# EAGLE design freeduino_V1.16-TH-WestfW-newreg (EAGLE 4.16)
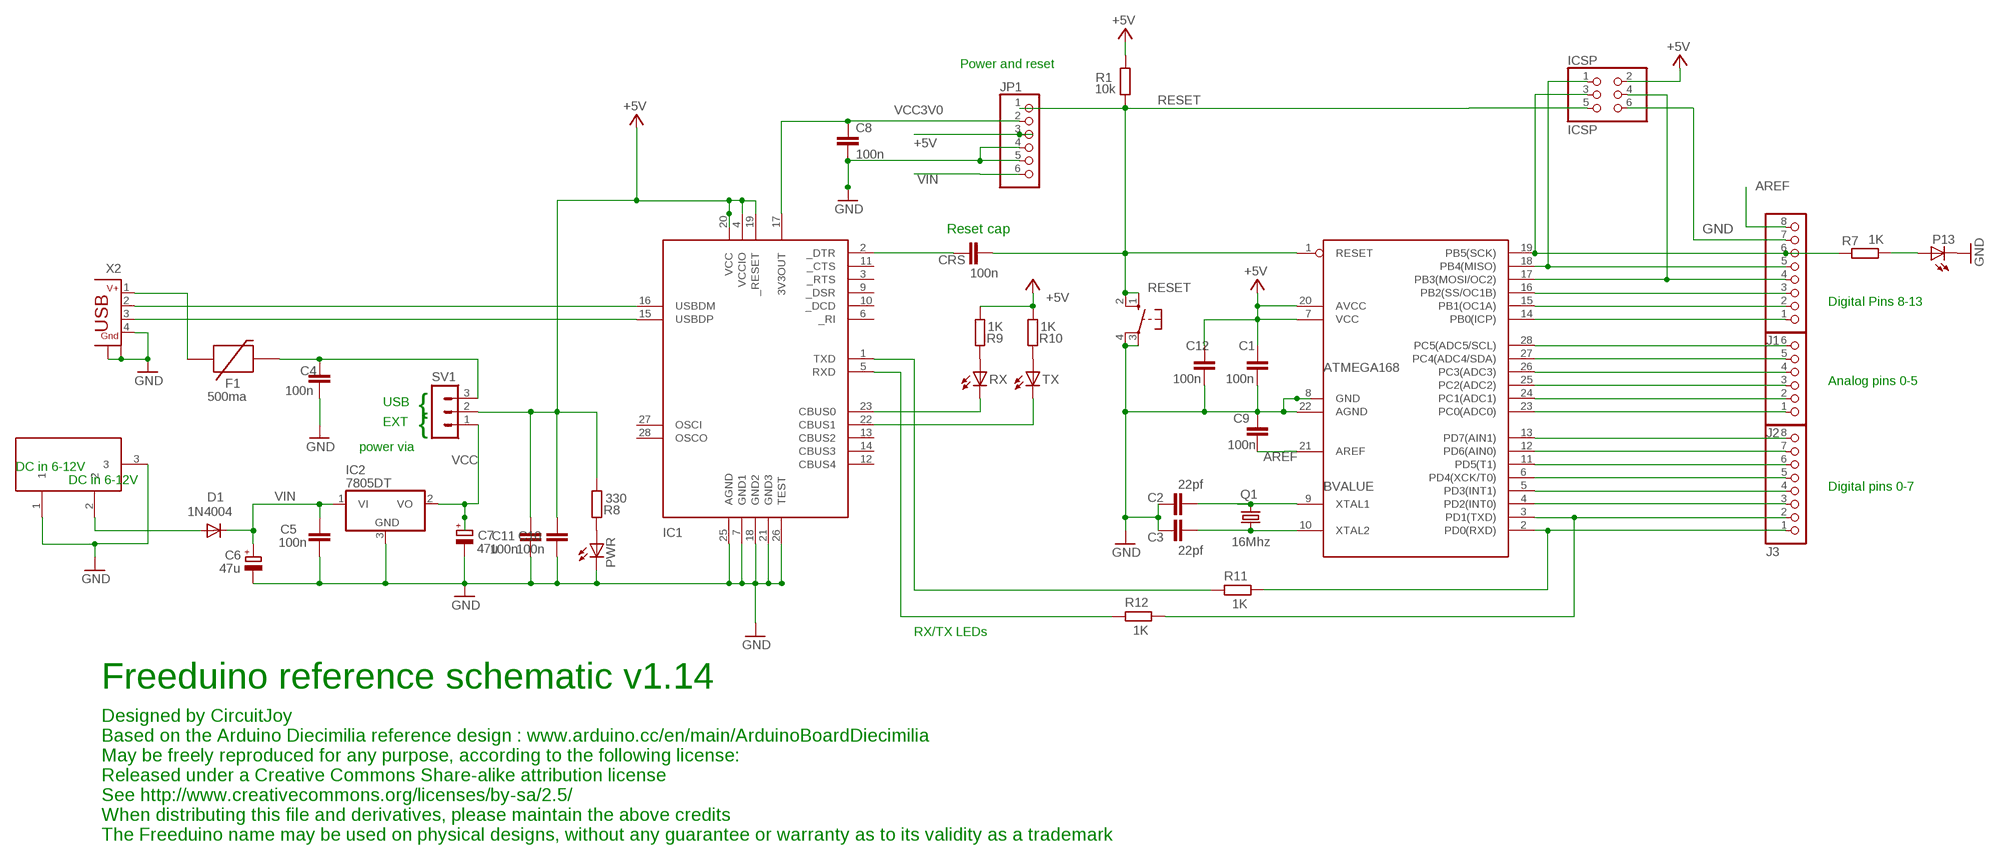
[diagram p0: schematic, sheet 1]

## Parts
BVALUE  ATMEGA168  MEGA8-P  [DIL28-3]
C1  100n  C-EU050-024X044  [C050-024X044]
C2  22pf  C-EU025-024X044  [C025-024X044]
C3  22pf  C-EU025-024X044  [C025-024X044]
C4  100n  C-EU050-024X044  [C050-024X044]
C5  100n  C-EU050-024X044  [C050-024X044]
C6  47u  CPOL-EUE3.5-8  [E3,5-8]
C7  47u  CPOL-EUE3.5-8  [E3,5-8]
C8  100n  C-EU050-024X044  [C050-024X044]
C9  100n  C-EU050-024X044  [C050-024X044]
C10  100n  C-EU050-024X044  [C050-024X044]
C11  100n  C-EUC1206  [C1206]
C12  100n  C-EU050-024X044  [C050-024X044]
CRS  100n  C-EU050-024X044  [C050-024X044]
D1  1N4004  DIODEPTH  [DIODE-0.4]
DC1  9V in  DC21MMX  [DC-21MM]
F1  500ma  PTCPTH  [PTC]
IC1  FT232RL  FT232RL-PINNED  [SSOP28DB]
IC2  7805DT  [TO252]
ICSP  ICSP  PINHD-2X3  [2X03]
J1  PINHD-1X8  [1X08]
J2  PINHD-1X6  [1X06]
J3  PINHD-1X8  [1X08]
JP1  PINHD-1X6  [1X06]
P13  LED3MM  [LED3MM]
PWR  LED3MM  [LED3MM]
Q1  16Mhz  CRYSTALHC49U-V  [HC49U-V]
R1  10k  R-EU_0204/7  [0204/7]
R7  1K  R-EU_0204/7  [0204/7]
R8  330  R-EU_0204/7  [0204/7]
R9  1K  R-EU_0204/7  [0204/7]
R10  1K  R-EU_0204/7  [0204/7]
R11  1K  R-EU_0204/7  [0204/7]
R12  1K  R-EU_0204/7  [0204/7]
RESET  10-XX  [B3F-10XX]
RX  LED3MM  [LED3MM]
SV1  MA03-1  [MA03-1]
TX  LED3MM  [LED3MM]
X2  CON-USB-B  [USB-WSHIELDPADS]

## Nets
+5V [power]: BVALUE.7(VCC) BVALUE.20(AVCC) C1.1 C10.2 C11.2 C12.1 IC1.4(VCCIO) IC1.19(_RESET) IC1.20(VCC) ICSP.2 JP1.3 R1.2 R8.1 R9.1 R10.1 SV1.2
AREF: BVALUE.21(AREF) C9.1 J1.8
GND [power]: BVALUE.8(GND) BVALUE.22(AGND) C1.2 C2.1 C3.1 C4.1 C5.1 C6.- C7.- C8.2 C9.2 C10.1 C11.1 C12.2 DC1.1 DC1.3 IC1.7(GND1) IC1.18(GND2) IC1.21(GND3) IC1.25(AGND) IC1.26(TEST) IC2.3(GND) ICSP.6 J1.7 JP1.4 JP1.5 P13.K(C) PWR.K(C) RESET.3(P) RESET.4(P1) X2.4 X2.SH1(GND) X2.SH2(GND)
M8RXD [finepitch]: IC1.1(TXD) R11.1
M8TXD [finepitch]: IC1.5(RXD) R12.1
N$2: BVALUE.15(PB1(OC1A)) J1.2
N$3: PWR.A R8.2
N$5 [finepitch]: IC1.23(CBUS0) RX.K(C)
N$6: BVALUE.9(XTAL1) C2.2 Q1.2
N$7 [power]: C4.2 F1.P$2 SV1.3
N$8 [power]: D1.A DC1.2
N$9 [finepitch]: IC1.16(USBDM) X2.2
N$10: BVALUE.4(PD2(INT0)) J3.3
N$11: BVALUE.5(PD3(INT1)) J3.4
N$12: BVALUE.6(PD4(XCK/T0)) J3.5
N$13: BVALUE.11(PD5(T1)) J3.6
N$14: BVALUE.12(PD6(AIN0)) J3.7
N$15: BVALUE.13(PD7(AIN1)) J3.8
N$16: BVALUE.23(PC0(ADC0)) J2.1
N$17: BVALUE.24(PC1(ADC1)) J2.2
N$18: BVALUE.25(PC2(ADC2)) J2.3
N$19: BVALUE.26(PC3(ADC3)) J2.4
N$20: BVALUE.27(PC4(ADC4/SDA)) J2.5
N$21: BVALUE.28(PC5(ADC5/SCL)) J2.6
N$22: BVALUE.3(PD1(TXD)) J3.2 R12.2
N$23: BVALUE.16(PB2(SS/OC1B)) J1.3
N$24 [finepitch]: IC1.15(USBDP) X2.3
N$26: BVALUE.18(PB4(MISO)) ICSP.1 J1.5
N$27 [power]: F1.P$1 X2.1
N$28: BVALUE.14(PB0(ICP)) J1.1
N$29 [finepitch]: IC1.22(CBUS1) TX.K(C)
N$31: BVALUE.10(XTAL2) C3.2 Q1.1
N$32: P13.A R7.1
N$34: R10.2 TX.A
N$36: R9.2 RX.A
N$37 [finepitch]: CRS.1 IC1.2(_DTR)
N$43: BVALUE.17(PB3(MOSI/OC2)) ICSP.4 J1.4
N$44: BVALUE.2(PD0(RXD)) J3.1 R11.2
RESET: BVALUE.1(RESET) CRS.2 ICSP.5 JP1.1 R1.1 RESET.1(S) RESET.2(S1)
SCK: BVALUE.19(PB5(SCK)) ICSP.3 J1.6 R7.2
VCC [power]: C7.+ IC2.2(VO) SV1.1
VCC3V0 [power]: C8.1 IC1.17(3V3OUT) JP1.2
VIN [power]: C5.2 C6.+ D1.C IC2.1(VI) JP1.6
Unconnected: IC1.3(_RTS) IC1.6(_RI) IC1.9(_DSR) IC1.10(_DCD) IC1.11(_CTS) IC1.12(CBUS4) IC1.13(CBUS2) IC1.14(CBUS3) IC1.27(OSCI) IC1.28(OSCO)

## Notes on the sheet
- Power and reset
- Reset cap
- Digital Pins 8-13
- Analog pins 0-5
- USB
- {
- EXT
- {
- power via
- DC in 6-12V
- DC in 6-12V
- Digital pins 0-7
- RX/TX LEDs
- Freeduino reference schematic v1.14
- Designed by CircuitJoy
- Based on the Arduino Diecimilia reference design : www.arduino.cc/en/main/ArduinoBoardDiecimilia
- May be freely reproduced for any purpose, according to the following license:
- Released under a Creative Commons Share-alike attribution license
- See http://www.creativecommons.org/licenses/by-sa/2.5/
- When distributing this file and derivatives, please maintain the above credits
- The Freeduino name may be used on physical designs, without any guarantee or warranty as to its validity as a trademark

## Library data of the parts
BVALUE = my-library:MEGA8-P: MICROCONTROLLER 8 Kbytes FLASH 1 kbytes SRAM 512 bytes EEPROM USART 4-channel 10 bit ADC 2-channel 8 bit ADC Source: avr.lbr
C1-C5 C8-C12 CRS = rcl:C-EU: CAPACITOR, European symbol
C6 C7 = rcl:CPOL-EU: POLARIZED CAPACITOR, European symbol
D1 = SparkFunEagle-6-6-07:DIODE: Diode These are standard reverse protection diodes and small signal diodes. SMA package can handle up to about 1A. SOD-323 can handle about 200mA. What the SOD-323 package when ordering, there are some mfgs out there that are 5-pin packages.
DC1 = powersupply:DC21MM
F1 = SparkFunEagle-6-6-07:PTC: Resettable Fuse PTC Resettable Fuse. Spark Fun Electronics SKU : COM-08357
IC1 = my-library:FT232RL-PINNED: USB UART FT232RL 4th Generation USB UART (USB <-> Serial) Controller. Spark Fun Electronics SKU : COM-00650
IC2 = linear:78*: Positive VOLTAGE REGULATOR Source: http://cache.national.com/ds/LM/LM78L05.pdf http://www.fairchildsemi.com/ds/LM/LM7805.pdf
ICSP = pinhead:PINHD-2X3: PIN HEADER
J1 J3 = pinhead:PINHD-1X8: PIN HEADER
J2 JP1 = pinhead:PINHD-1X6: PIN HEADER
P13 PWR RX TX = led:LED: LED OSRAM: - CHIPLED LG R971, LG N971, LY N971, LG Q971, LY Q971, LO R971, LY R971 LH N974, LH R974 LS Q976, LO Q976, LY Q976 LO Q996 - Hyper CHIPLED LW Q18S LB Q993, LB Q99A, LB R99A - SideLED LS A670, LO A670, LY A670, LG A670, LP A670 LB A673, LV A673, LT A673, LW A673 LH A674 LY A675 LS A676, LA A676, LO A676, LY A676, LW A676 LS A679, LY A679, LG A679 - Hyper Micro SIDELED® LS Y876, LA Y876, LO Y876, LY Y876 LT Y87S - SmartLED LW L88C, LW L88S LB L89C, LB L89S, LG L890 LS L89K, LO L89K, LY L89K LS L896, LA L896, LO L896, LY L896 - TOPLED LS T670, LO T670, LY T670, LG T670, LP T670 LSG T670, LSP T670, LSY T670, LOP T670, LYG T670 LG T671, LOG T671, LSG T671 LB T673, LV T673, LT T673, LW T673 LH T674 LS T676, LA T676, LO T676, LY T676, LB T676, LH T676, LSB T676, LW T676 LB T67C, LV T67C, LT T67C, LS T67K, LO T67K, LY T67K, LW E67C LS E67B, LA E67B, LO E67B, LY E67B, LB E67C, LV E67C, LT E67C LW T67C LS T679, LY T679, LG T679 LS T770, LO T770, LY T770, LG T770, LP T770 LB T773, LV T773, LT T773, LW T773 LH T774 LS E675, LA E675, LY E675, LS T675 LS T776, LA T776, LO T776, LY T776, LB T776 LHGB T686 LT T68C, LB T68C - Hyper Mini TOPLED® LB M676 - Mini TOPLED Santana® LG M470 LS M47K, LO M47K, LY M47K Source: http://www.osram.convergy.de/
Q1 = crystal:CRYSTAL: CRYSTAL
R1 R7-R12 = rcl:R-EU_: RESISTOR, European symbol
RESET = switch-omron:10-XX: OMRON SWITCH
SV1 = con-lstb:MA03-1: PIN HEADER
X2 = mylib4:CON-USB-B: BERG USB connector

## Net classes
0 default: width 0.203 mm, drill 0.203 mm
1 power: width 0.6 mm, drill 0.305 mm
2 finepitch: width 0.203 mm, drill 0.203 mm

## Board
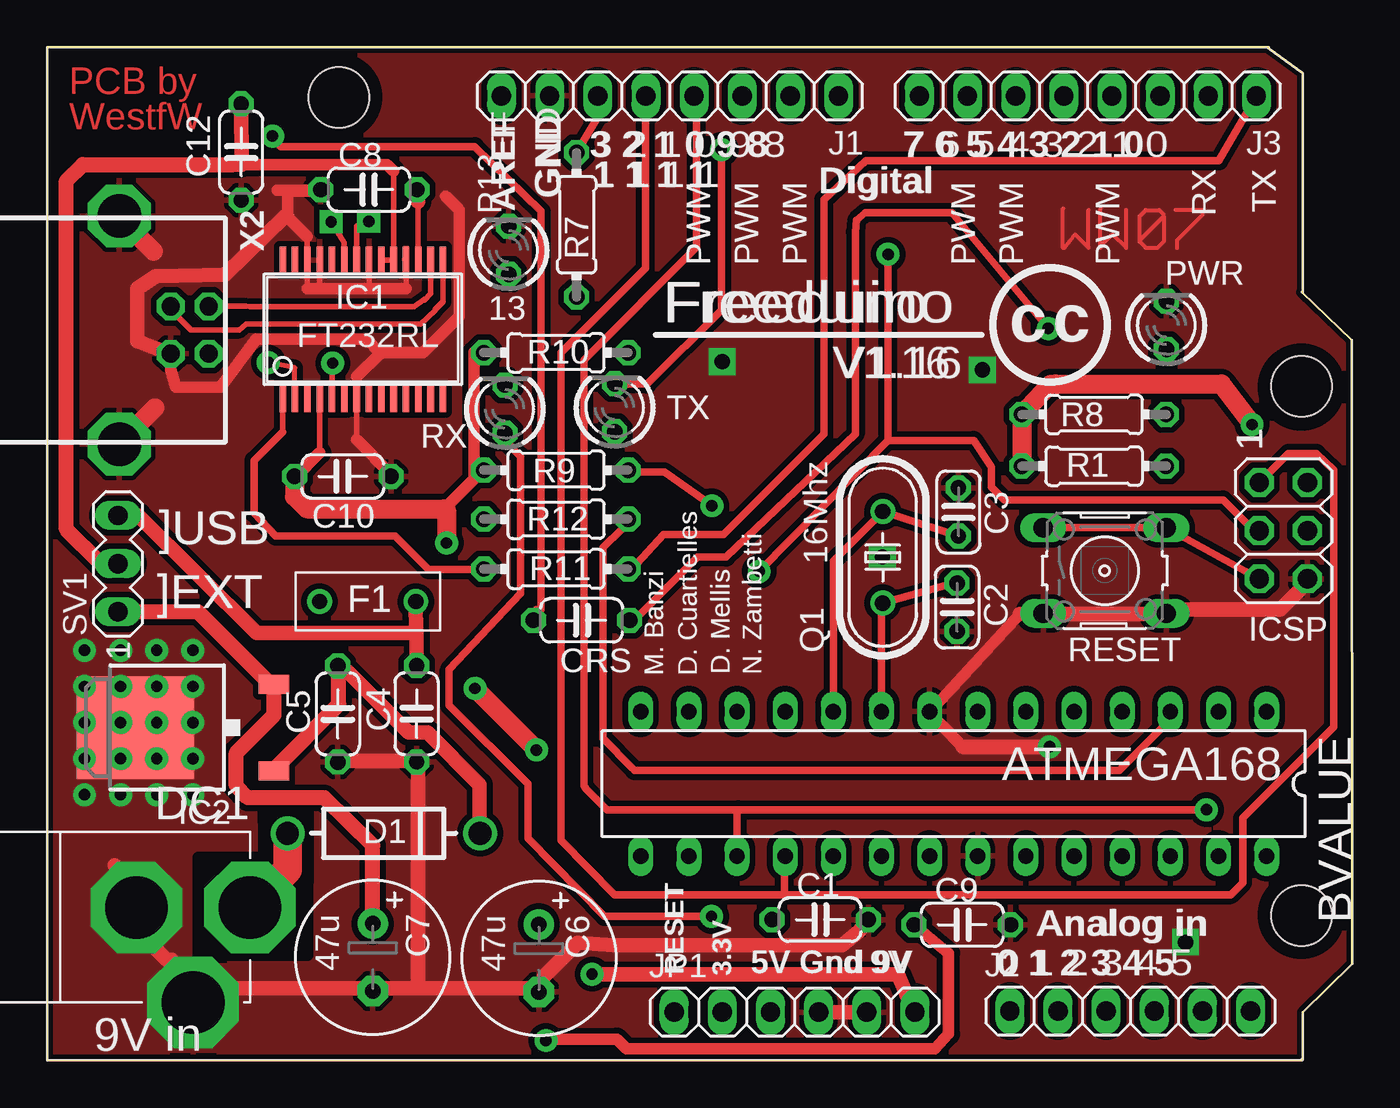
[diagram p1: board, top side]
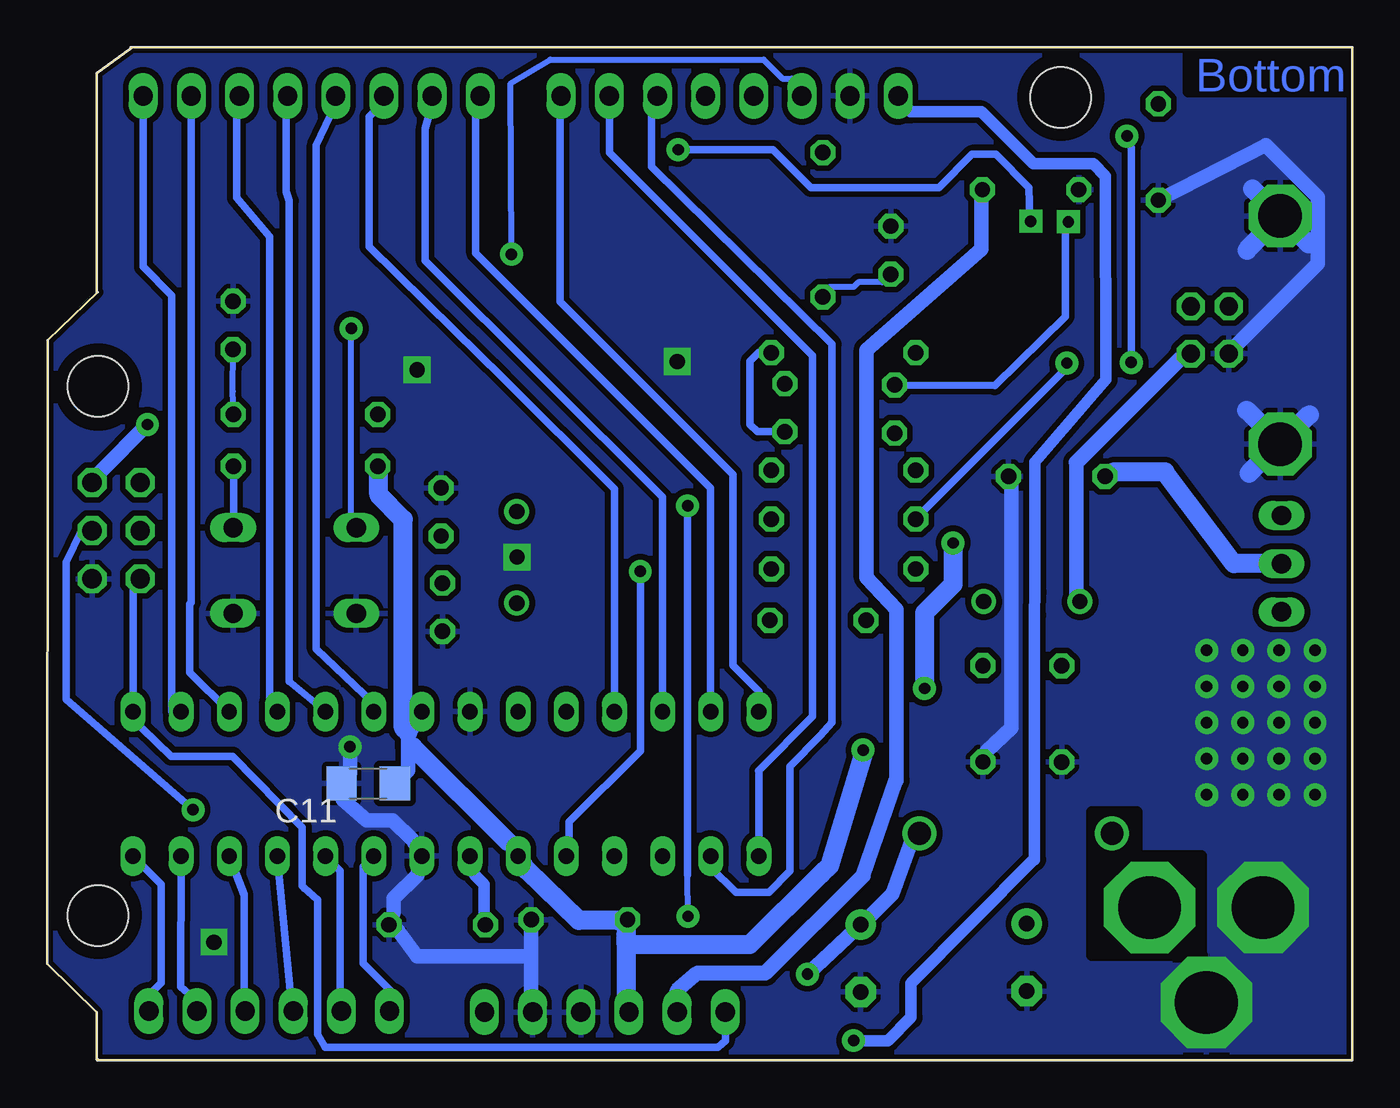
[diagram p2: board, bottom side, seen from below]

Size 68.83 x 53.44 mm. Coordinates in mm from the lower left corner, seen from the top.
Outline: 66.2,0.03 66.22,0.06 66.22,2.55 68.83,5.1
Outline: 66.22,40.54 66.22,52.09 64.39,53.44
Outline: 66.18,0.05 66.2,0 63.63,0.01 0,0.01 0,53.44 64.44,53.44
Outline: 68.83,5.11 68.81,38 66.17,40.54
Copper layers (1*16): Top 0.035mm / dielectric 1.5mm / Bottom 0.035mm
Design rules "default": minimum track width 10mil, minimum drill 0.6mm, track to track 8mil, track to pad 8mil, pad to pad 8mil, via to via 12mil, smd to smd 8mil, copper to edge 10mil, drill to drill 15mil, minimum pad ring 10mil, minimum via ring 12mil, stop-mask expansion 4mil, vias tented up to drill 0mil, thermal gap 10mil
Holes 3.2 mm at 66.17,35.57 66.17,7.63 15.37,50.81
tRestrict: area 13.5,48.9 to 17.3,52.7; area 64.3,33.6 to 68,37.4; area 64.3,5.8 to 68,9.6; 10 lines
bRestrict: area 13.5,48.9 to 17.3,52.7; area 64.3,33.6 to 68,37.4; area 64.3,5.8 to 68,9.6; 8 lines

### Footprints (pad centres in the part's own frame; a part is rotated, then mirrored left to right if it is on the bottom)
DIL28-3 = drill 0.813 long: 1 -16.51,-3.81; 2 -13.97,-3.81; 3 -11.43,-3.81; 4 -8.89,-3.81; 5 -6.35,-3.81; 6 -3.81,-3.81; 7 -1.27,-3.81; 8 1.27,-3.81; 9 3.81,-3.81; 10 6.35,-3.81; 11 8.89,-3.81; 12 11.43,-3.81; 13 13.97,-3.81; 14 16.51,-3.81; 15 16.51,3.81; 16 13.97,3.81; 17 11.43,3.81; 18 8.89,3.81; 19 6.35,3.81; 20 3.81,3.81; 21 1.27,3.81; 22 -1.27,3.81; 23 -3.81,3.81; 24 -6.35,3.81; 25 -8.89,3.81; 26 -11.43,3.81; 27 -13.97,3.81; 28 -16.51,3.81
C050-024X044 = drill 0.813 octagon: 1 -2.54,0; 2 2.54,0
C025-024X044 = drill 0.813 octagon: 1 -1.27,0; 2 1.27,0
E3,5-8 = drill 0.813 pad 1.6 round: + -1.778,0 | drill 0.813 pad 1.6 octagon: - 1.778,0
C1206 = smd 1.6 x 1.8: 1 -1.4,0; 2 1.4,0
DIODE-0.4 = drill 1.2 round: A 0,0; C 10.16,0
DC-21MM = drill 3.302 pad 4.826 octagon: 1 -5.08,-3.353; 2 -0.076,-6.35; 3 -0.076,-0.356
PTC = drill 0.8 round: P$1 -2.54,0; P$2 2.54,0
SSOP28DB = smd 0.348 x 1.397: 1 -4.225,-3.656; 2 -3.575,-3.656; 3 -2.925,-3.656; 4 -2.275,-3.656; 5 -1.625,-3.656; 6 -0.975,-3.656; 7 -0.325,-3.656; 8 0.325,-3.656; 9 0.975,-3.656; 10 1.625,-3.656; 11 2.275,-3.656; 12 2.925,-3.656; 13 3.575,-3.656; 14 4.225,-3.656; 15 4.225,3.656; 16 3.575,3.656; 17 2.925,3.656; 18 2.275,3.656; 19 1.625,3.656; 20 0.975,3.656; 21 0.325,3.656; 22 -0.325,3.656; 23 -0.975,3.656; 24 -1.625,3.656; 25 -2.275,3.656; 26 -2.925,3.656; 27 -3.575,3.656; 28 -4.225,3.656
TO252 = smd 1 x 1.6: 1 -2.28,-4.8; 2 2.28,-4.8 | smd 5.4 x 6.2: 3 0,2.5
2X03 = drill 1.016 octagon: 1 -2.54,-1.27; 2 -2.54,1.27; 3 0,-1.27; 4 0,1.27; 5 2.54,-1.27; 6 2.54,1.27
1X08 = drill 1.016 long: 1 -8.89,0; 2 -6.35,0; 3 -3.81,0; 4 -1.27,0; 5 1.27,0; 6 3.81,0; 7 6.35,0; 8 8.89,0
1X06 = drill 1.016 long: 1 -6.35,0; 2 -3.81,0; 3 -1.27,0; 4 1.27,0; 5 3.81,0; 6 6.35,0
LED3MM = drill 0.813 octagon: A -1.27,0; K 1.27,0
HC49U-V = drill 0.813 round: 1 -2.413,0; 2 2.413,0
0204/7 = drill 0.813 octagon: 1 -3.81,0; 2 3.81,0
B3F-10XX = drill 1.016 long: 1 -3.251,2.261; 2 3.251,2.261; 3 -3.251,-2.261; 4 3.251,-2.261
MA03-1 = drill 1.016 long: 1 -2.54,0; 2 0,0; 3 2.54,0
USB-WSHIELDPADS = drill 0.95 octagon: 1 1.25,4.71; 2 -1.25,4.71; 3 -1.25,2.71; 4 1.25,2.71 | drill 2.3 octagon: SH1 -6.02,0; SH2 6.02,0

### Placement (x,y rotation side)
BVALUE  47.81,14.59 180 top
C1  40.76,7.42 0 top
C2  47.99,23.91 90 top
C3  48.06,28.94 270 top
C4  19.48,18.29 90 top
C5  15.32,18.27 90 top
C6  25.93,5.39 270 top
C7  17.16,5.43 270 top
C8  16.96,45.94 180 top
C9  48.26,7.15 0 top
C10  15.58,30.81 180 top
C11  51.9,14.61 0 bottom
C12  10.22,47.92 270 top
CRS  28.18,23.22 0 top
D1  12.66,11.98 0 top
DC1  4.34,8.14 90 top
F1  16.9,24.2 0 top
IC1  16.64,38.57 0 top
IC2  7.15,17.56 90 top
ICSP  65.2,27.95 270 top
J1  32.84,50.88 180 top
J2  57.12,2.6 0 top
J3  54.89,50.88 180 top
JP1  39.42,2.55 0 top
P13  24.33,42.74 90 top
PWR  59.03,38.78 90 top
Q1  44.07,26.54 270 top
R1  55.21,31.35 180 top
R7  27.92,44.08 90 top
R8  55.21,34.08 0 top
R9  26.83,31.14 0 top
R10  26.83,37.34 0 top
R11  26.83,25.92 0 top
R12  26.83,28.55 0 top
RESET  55.78,25.84 0 top
RX  24.13,34.36 90 top
SV1  3.72,26.21 90 top
TX  29.93,34.43 90 top
U$3  [CC-LOGO]  53.79,39.41 0 top
X2  3.8,38.53 270 top

### Tracks (layer width: path | path; a pad name or v marks a point on that pad's centre or on a via)
+5V  (via drill 0.6)
  Top 0.3: IC1.20 17.59,42.26 | IC1.20 | IC1.20 IC1.19 18.26,46.9 | 14.36,32.05 IC1.4
  Top 0.6: C10.2 13.04,30.78 13.06,30.75 14.36,32.05 | 22.98,31.15 23,31.14 R9.1 | 20.92,29.09 22.98,31.15 | 22.98,31.15 | 22.98,31.15 22.51,30.67 22.51,37.36 22.9,37.34 | 22.9,37.34 22.98,37.42 | 22.9,37.34 R10.1 | 18.26,46.9 17.91,47.26 9.82,47.26
  Top 0.762: C12.1 10.24,47.26 9.82,47.26 | 20.92,29.09 21.05,29.05
  Top 0.8: 9.82,47.26 1.86,47.26 1,46.41 1,28.02 2.75,26.27 3.62,26.27 | 51.43,34.17 51.41,34.17 R8.1 | R1.2 51.43,31.38 | 53.18,35.68 53.17,35.67 52.92,35.67 | 3.64,26.31 3.62,26.27 | SV1.2 3.64,26.31 | 3.62,26.27 3.66,26.27 3.64,26.31
  Top 1: C10.2 13.04,29.75 13.7,29.09 20.92,29.09 | v63.55,33.55 61.93,35.68 53.18,35.68 | 21.05,29.05 v21.05,27.3 | v22.55,19.62 v25.8,16.37 | 51.43,31.38 51.43,34.17 | R8.1 52.92,35.67
  Bottom 0.762: 12.55,31.05 C10.2 | v63.55,33.55 66.05,31.05 ICSP.2 | 38.3,3.55 JP1.3 | 49.8,16.55 49.8,17.3 49.55,17.55 BVALUE.7 | 49.8,16.55 49.8,15.3 C11.2 | BVALUE.20 44.55,11.55 | 49.55,16.55 49.8,16.55 | v25.8,16.37 25.76,16.28
  Bottom 0.8: 51.35,31.3 R1.2
  Bottom 1: 12.55,31.05 9.87,31.05 6.23,26.21 SV1.2 | 38.3,6.1 38.3,3.55 | 38.3,6.1 38.3,6.55 C1.1 38.76,7.37 40.8,7.37 43.55,10.05 BVALUE.20 | 44.55,11.55 49.55,16.55 | 49.8,17.3 50.05,17.55 50.05,28.55 51.35,29.85 51.35,31.3 | v21.05,27.3 21.05,25.11 22.55,23.61 v22.55,19.62 | 25.76,16.28 27.57,10.27 28.01,9.84 31.79,6.1 38.3,6.1
AREF  (via drill 0.6)
  Top 0.4: v26.3,1.05 26.3,1.14 26.36,1.2 26.43,1.12
  Top 0.6: C9.1 47.54,5.65 47.54,1.39 46.83,0.6 30.56,0.6 30.04,1.12 26.43,1.12
  Bottom 0.6: C9.1 45.8,7.8 45.8,9.3 46.3,9.8 BVALUE.21 | 16.75,10.6 16.77,10.57 | 16.75,10.6 16.75,23.49 16.73,24.7 16.73,31.57 12.98,35.91 13.02,46.64 13.64,47.3 16.81,47.3 19.56,50.05 23.3,50.05 J1.8 | v26.3,1.05 24.48,1.05 23.26,2.27 23.26,4.05 16.79,10.6 16.75,10.6
GND  (via drill 0.6, 0.8)
  Top 0.2: 53.57,44.94 53.57,42.87 53.65,42.87 54.21,43.59 54.92,42.87 54.92,44.86 | 55.56,42.95 55.56,44.94 | 55.56,42.95 55.56,42.87 | 55.56,42.95 56.19,43.59 | 56.19,43.59 | 56.19,43.59 56.9,42.87 56.9,44.86 | 59.52,44.86 60.95,44.86 60.95,44.62 | 60.95,44.62 | 60.95,44.62 59.6,43.27 59.6,42.87 | 57.62,43.19 57.62,44.54 57.94,44.86 58.65,44.86 58.89,44.62 58.89,44.54 | 58.89,44.54 58.89,43.19 58.57,42.87 57.94,42.87 57.62,43.19 | 57.62,43.19 57.62,43.27 58.89,44.54
  Top 0.3: 13.71,40.71 IC1.26 13.71,42.24 13.7,42.26 13.7,43.45 | 18.91,42.26 18.86,42.26 | 18.91,42.26 IC1.18 | 18.94,40.71 18.94,42.26 18.91,42.26 | IC1.21 16.96,40.71 17.03,40.71 | 16.08,40.71 16.08,40.63 16.31,40.63 | IC1.25 14.36,40.71 14.41,40.71 | 16.31,32.74 IC1.7 16.31,36.07
  Top 0.6: 14.44,45.94 14.57,46.07 | 14.44,45.94 C8.2 | 14.41,45.91 14.36,45.86 12.67,45.86 12.67,44.48 13.7,43.45 | 14.41,45.91 14.44,45.94 | 13.71,40.71 14.41,40.71 16.08,40.71 17.03,40.71 18.94,40.71 | C10.1 18.12,30.89 18.14,30.91 16.31,32.74 | 16.31,36.07 17.55,37.3 | 17.55,37.3 17.59,37.34 19.81,37.34 21.71,39.24 21.71,44.88 21,45.59 | 6.49,36.45 6.76,35.51 9.14,35.51 11,38.05 16.87,38.05 17.55,37.3 | 17.55,37.3 17.59,37.26 | 17.55,37.3 | 46.63,18.69 46.54,18.6 BVALUE.8 47.05,17.8 48.3,16.55 | BVALUE.8 51.3,23.55 | 14.41,45.91 12.11,45.91
  Top 0.762: 6.37,37.32 4.73,37.95 4.73,40.7 5.72,41.37 9.38,41.45 12.55,44.55 12.67,44.48 | 51.3,23.55 RESET.3 53.3,23.55 57.8,23.55 RESET.4 59.8,23.8 65.05,23.8 66.05,24.8 ICSP.6 | 3.55,10.3 DC1.3 5.8,5.8 6.3,5.3 6.55,5.3 DC1.1 10.05,3.8 16.55,3.8 C7.- 17.8,3.8 19.55,3.8 | JP1.4 41.3,2.55 42.55,2.55 JP1.5 | C5.1 15.8,15.8 19.05,15.8 C4.1 19.55,15.3 19.55,3.8 | 19.55,3.8 25.3,3.8 C6.- 26.19,4.44 28,6.2 27.96,6.2 29.92,6.07 41.92,6.07 42.8,6.8 C1.2 | v52.87,16.55 48.3,16.55
  Top 1: 3.78,44.38 3.9,44.38 5.61,42.68 | 3.9,32.9 4.14,32.9 5.66,34.42
  Bottom 0.762: 6.05,37.8 1.8,42.05 1.8,45.55 4.55,48.3 C12.2 | 43.32,5.48 43.3,3.55 JP1.5 | 43.32,5.48 43.3,6.55 C1.2 | 43.32,5.48 49.32,5.48 50.3,6.8 C9.2 50.55,7.8 50.55,8.55 49.3,9.8 BVALUE.22 49.57,11.62 50.61,12.66 51.99,12.66 53.26,13.78 C11.1 52.87,15.14 v52.87,16.55 | C10.1 17.97,30.3 17.97,17.55 19.3,16.3 C4.1
  Bottom 1: 3.84,44.44 5.55,42.74 | 4.04,32.78 5.57,34.31 | 5.25,45.97 3.54,44.26 3.56,44.26 3.8,44.5 3.8,44.51 X2.SH1 | 2.29,43.07 4,44.78 | 2.25,34.07 5.43,30.97
  other vias: 35.6,36.86 49.33,36.43 60.04,6.23 44.05,26.55 1.96,14.01 3.86,14.01 5.76,14.01 7.67,14.01 7.67,21.63 5.76,21.63 3.86,21.63 1.95,21.63 1.96,19.72 3.86,19.72 5.76,19.72 7.67,19.72 1.96,17.82 3.86,17.82 5.76,17.82 7.67,17.82 1.96,15.92 3.86,15.92 5.76,15.92 7.67,15.92
  pour Bottom (isolate 0.305): -1.3,53.92 69.4,53.92 69.4,-0.59 -1.14,-0.59 -1.14,53.84
  pour Top (isolate 0.305): -6.3,54.64 70.28,54.64 70.28,-1.38 -6.54,-1.38 -6.54,54.64
  pour Bottom (isolate 0.4, rank 5, no thermals): -1.89,11.63 -1.89,-1.2 13.2,-1.2 13.2,11.65 -1.87,11.65
  pour Top (isolate 0.4, rank 5, no thermals): -1.08,11.35 -1.08,-0.77 11.32,-0.77 11.32,11.35
  pour Top (isolate 0.4, rank 6, no thermals): 0.69,22.26 7.03,22.26 8.94,20.36 8.94,14.01 8.3,13.38 0.69,13.38
M8RXD
  Top 0.3: 12.41,33.16 IC1.1 | 23.2,25.89 23.18,25.92 R11.1
  Top 0.4: 12.41,33.16 10.9,31.65 10.9,28.87 12.05,27.66 18.34,27.66 20.11,25.89 23.2,25.89
M8TXD  (via drill 0.6)
  Top 0.3: IC1.5 15.01,36.75 v15.05,36.78
  Bottom 0.3: 23.06,28.53 23.04,28.55 R12.1 | v15.05,36.78 15.05,36.55
  Bottom 0.4: 15.05,36.55 23.04,28.55
N$2
  Bottom 0.4: BVALUE.15 31.3,15.22 31.3,15.3 | 39.19,51.09 39.33,51.23 | 39.19,51.09 J1.2 | 39.19,51.09 39.17,51.07 39.17,47.89 28.46,37.18 28.46,18.14 31.3,15.3 | 31.3,15.3 31.32,15.28
N$3
  Bottom 0.305: R8.2 59.01,34.14 59.05,35.3 PWR.A
N$5  (via drill 0.6)
  Top 0.3: IC1.23 15.66,43.15 v14.97,44.24
  Bottom 0.3: v14.97,44.24 | 15.13,44.08 v14.97,44.24
  Bottom 0.4: RX.K 18.86,35.59 15.13,39.24 15.13,44.08
N$6
  Top 0.4: BVALUE.9 44,23.96 44.09,24.05 44.07,24.07 Q1.2 47.94,25.2 C2.2
N$7
  Top 0.762: 19.46,22.55 19.48,22.55 C4.2 | 19.46,22.55 19.44,22.51 F1.P$2 | SV1.3 4.8,28.76 11.05,22.55 19.46,22.55
N$8
  Top 1.5: D1.A 12.67,12.03 | D1.A | DC1.2 12.67,10.05 D1.A
N$9
  Top 0.3: IC1.16 20.21,40.44 19.89,40.12 19.89,40.16 19.33,39.76 10.68,39.76 10.46,39.79 8.57,39.79 8.52,39.74 8.51,39.76 X2.2
  Top 0.4: X2.2 8.5,39.76 X2.2
N$10
  Bottom 0.4: BVALUE.4 57.1,18.49 57.1,43.45 58.85,45.51 58.85,50.99 58.8,50.99 J3.3
N$11
  Bottom 0.4: BVALUE.5 56.07,20 56.07,45.35 56.23,45.83 56.23,50.99 56.16,51.06 | 56.16,51.06 56.15,51.07 | 56.16,51.06 J3.4
N$12
  Bottom 0.4: BVALUE.6 51.62,18.84 54.64,21.71 54.64,48.29 53.4,50.88 | 53.4,50.88 53.37,50.91 | 53.4,50.88 J3.5
N$13
  Bottom 0.4: BVALUE.11 38.92,30.14 44.8,36.03 47.38,38.53 51.87,42.93 51.87,49.8 51.07,50.59 51.08,50.6 J3.6
N$14
  Bottom 0.4: BVALUE.12 36.38,29.71 48.89,42.18 48.89,49.16 48.4,50.88 | 48.4,50.88 48.37,50.91 | 48.4,50.88 J3.7
N$15
  Bottom 0.4: BVALUE.13 33.84,30.18 46.23,42.58 46.23,50.67 45.99,50.91 45.97,50.91 | 45.97,50.91 45.95,50.91 | 45.97,50.91 J3.8
N$16
  Bottom 0.4: BVALUE.23 52.18,10.21 52.18,5.12 50.76,3.7 50.76,2.58 | 50.76,2.58 50.76,2.35 | 50.76,2.58 J2.1
N$17
  Bottom 0.4: J2.2 53.37,2.66 53.37,10 BVALUE.24
N$18
  Bottom 0.4: 55.91,2.54 55.91,2.35 | 55.91,2.54 J2.3 | BVALUE.25 55.91,2.6 55.91,2.54
N$19
  Bottom 0.4: J2.4 58.45,2.66 58.45,8.72 BVALUE.26
N$20
  Bottom 0.4: J2.5 60.71,2.82 60.59,2.82 61.78,3.88 BVALUE.27
N$21
  Bottom 0.4: BVALUE.28 62.82,9.28 62.82,4.09 63.53,3.38 63.53,2.65 J2.6
N$22
  Top 0.305: 30.84,15.44 30.97,15.3
  Top 0.4: 30.84,15.44 29.3,16.98 29.3,27.05 30.3,28.05 R12.2 | 30.97,15.3 56.55,15.3 58.8,17.55 BVALUE.3
  Bottom 0.4: BVALUE.3 61.31,20.47 61.31,24.09 61.23,24.17 61.23,50.87 J3.2
N$23
  Bottom 0.4: BVALUE.16 33.84,10.19 32.5,8.85 30.76,8.85 29.65,10 29.65,15.52 28.06,17.11 27.43,17.82 27.43,37.78 36.95,47.14 36.95,50.43 36.63,50.75 36.65,50.77 J1.3
N$24
  Top 0.3: 6.53,39.59 7.59,38.53 10.13,38.53 10.48,38.85 19.69,38.85 20.44,39.56 20.44,39.6 20.86,40.02 IC1.15 | 6.53,39.59 6.49,39.62 | 6.53,39.59 6.56,39.62 6.54,39.64 6.54,39.78
  Top 0.4: 6.53,39.79 6.54,39.78 X2.3
N$26
  Top 0.4: J1.5 31.55,50.86 31.55,41.78 27.11,37.34 27.11,11.61 29.93,8.73 38.89,8.73 | ICSP.1 65.47,32.02 66.94,32.02 67.86,31.15 67.86,17.58 63.05,12.78 63.05,9.37 62.42,8.73 38.89,8.73 | BVALUE.18 38.89,10.75 38.89,8.73
N$27
  Bottom 0.762: 14.55,31.55 14.55,24.55 F1.P$1
  Bottom 0.8: 14.55,31.55 9.09,37 | 9.09,37 9.05,37.05 | X2.1 8.49,37.29 | X2.1 | X2.1 8.52,37.26 8.8,37.26 9.08,36.98 9.09,37 | 9.09,37
N$28
  Bottom 0.4: BVALUE.14 31.3,19.47 32.66,20.84 32.66,30.91 41.79,40.04 41.79,50.59 41.87,50.67 41.73,50.81 J1.1
N$29  (via drill 0.6)
  Top 0.3: IC1.22 16.31,44 v16.95,44.26
  Top 0.4: v35.55,48.05 35.55,39.59 31.63,35.67 30.01,35.67 29.98,35.7 TX.K
  Bottom 0.254: 16.99,44.2 v16.95,44.26 17.01,44.4
  Bottom 0.3: 16.95,44.4 v16.95,44.26 17.03,44.48 17.03,44.26
  Bottom 0.4: v35.55,48.05 30.55,48.05 28.55,46.05 21.8,46.05 20.05,47.8 18.8,47.8 17.05,46.05 17.01,44.4
N$31
  Top 0.4: BVALUE.10 41.46,26.34 Q1.1 C3.2
N$32
  Bottom 0.305: P13.A 24.8,41.05 26.05,41.05 26.3,40.8 27.55,40.8 R7.1
N$34
  Bottom 0.4: TX.A 31.36,33.16 31.75,33.55 31.75,36.9 31.32,37.34 30.58,37.34 R10.2
N$36  (via drill 0.6)
  Top 0.305: 29.38,7.6 29.19,7.79
  Top 0.4: v35.03,7.6 29.38,7.6 25.35,11.72 25.35,14.58 21.2,18.71 21.2,20.62 24.97,24.64 24.97,31.86 24.13,32.7 RX.A | v35.05,29.26 32.55,31.05 31.3,31.05 R9.2
  Bottom 0.305: v35.03,7.6 35.05,9.8
  Bottom 0.4: 35.05,9.8 v35.05,29.26
N$37  (via drill 0.6)
  Top 0.254: v11.65,36.82 13.05,36.55 13.05,35.55 IC1.2
  Top 0.4: v11.87,48.76 12.3,48.22 22.54,48.22 26.04,44.8 26.05,44.8 26.05,23.8 25.8,23.8 CRS.1
  Bottom 0.4: v11.65,36.82 11.64,45.75 11.64,48.13 v11.87,48.76
N$43  (via drill 0.6)
  Top 0.4: J1.4 34.14,50.91 34.25,50.91 34.25,42.89 28.3,36.94 28.3,14.49 28.42,14.33 | 28.42,14.33 | 36.43,13.22 29.53,13.22 28.42,14.33 | 36.43,13.22 v61.15,13.22 | 36.43,13.22 36.38,13.16 BVALUE.17
  Bottom 0.4: v61.15,13.22 67.84,19.04 67.84,26.3 67.04,27.93 ICSP.4
N$44
  Top 0.305: 43.18,47.48 43.26,47.46 | 63.74,50.81 J3.1
  Top 0.4: 43.18,47.48 40.96,45.42 40.96,33.04 35.67,27.73 32.5,27.73 30.82,25.9 R11.2 | 43.26,47.46 61.8,47.46 63.74,50.81
  Bottom 0.4: BVALUE.2 62.26,18.4 62.26,40.36 63.77,41.86 63.77,50.87 J3.1
RESET  (via drill 0.6)
  Top 0.4: v52.8,38.61 47.71,44.73 43.15,44.73 42.68,44.32 42.62,43.7 42.62,33.05 35.8,26.55 34.3,26.55 31.3,23.55 CRS.2 | ICSP.5 59.05,28.1 RESET.2 52.46,28.1 | 52.46,28.1 RESET.1 | 52.46,28.1 52.46,28.25
  Bottom 0.305: v52.8,38.61 52.81,33.55 52.81,28.8 RESET.1 | 64.3,24.8 ICSP.5 | 55.38,9.21 55.3,9.05
  Bottom 0.4: 64.3,24.8 64.3,19.3 BVALUE.1 64.3,18.41 64.32,18.34 64.64,18.3 62.3,16.05 59.05,16.05 55.38,12.3 55.38,9.21 55.28,9.09 54.58,8.46 54.58,1.37 54.17,0.7 33.46,0.7 33.07,1.03 JP1.1 | R1.1 59.01,31.35 59.01,28.1 RESET.2
SCK  (via drill 0.6)
  Top 0.305: 27.86,47.81 R7.2
  Top 0.4: 27.86,47.81 29.05,49.8 J1.6 | v37.55,25.8 44.34,32.71 | 44.34,32.71 48.86,32.71 49.8,31.3 49.8,30.24 50.48,29.56 62.02,29.56 63.77,27.82 63.9,27.95 ICSP.3 | 44.34,32.71 v44.34,42.53
  Bottom 0.305: v44.34,42.53 44.38,51.55 42.3,52.8 31.05,52.8 30.05,51.8 29.55,51.8 J1.6
  Bottom 0.4: v37.55,25.8 37.55,16.34 41.3,12.59 41.3,11.8 BVALUE.19
VCC
  Top 0.8: SV1.1 7.95,23.67 11.78,19.84 IC2.2 11.95,18.22 9.97,16.23 9.97,14.49 10.56,13.85 14.61,13.85 17.16,11.34 C7.+
  Top 1: C7.+
VCC3V0
  Top 0.3: 19.56,45.3 IC1.17
  Top 0.6: 19.56,45.3 19.56,45.9 19.65,45.99 | C8.1 19.55,45.3
  Top 0.762: 19.55,45.3 19.56,45.3
  Bottom 0.762: 24.05,14.76 24.05,23.8 25.62,25.48 25.62,37.48 19.55,42.8 19.55,45.3 C8.1
  Bottom 0.8: JP1.2 35.61,3.69 34.53,4.61 30.96,4.61 25.8,9.73 24.05,14.76
VIN  (via drill 0.6)
  Top 0.762: v28.73,4.55 44.86,4.55 45.3,3.55 JP1.6 | C5.2 15.8,20.55 19.05,17.3 20.05,17.3 22.8,14.55 22.8,12.8 D1.C
  Top 0.8: IC2.1 11.95,15.36 15.37,18.77 15.37,20.97 15.32,20.93 C5.2
  Bottom 0.762: D1.C 23.11,11.93 24.25,8.77 25.83,7.2 25.83,7.19 25.79,7.16 C6.+ 25.84,7.24 v28.73,4.55

### Text on the board
Top: PCB by | WestfW
Bottom: Bottom
tPlace: ]USB | ]EXT | RESET | 3.3V
tNames: 3 2 1 0 9 8 | 7 6 5 4 3 2 1 0 | RX | TX | 1 1 1 1 | Digital | AREF | GND | PWM | PWM | PWM | PWM | PWM | PWM | 13 | Freeduino | V1.16 | 1 | F1 | M. Banzi | D. Cuartielles | D. Mellis | N. Zambetti | Analog in | 5V Gnd 9V | 0 1 2 3 4 5
Edit History: 20070917 WestfW: Move (CC) symbol, use silk_gen to get 5mil widths | 20070917 WestfW: Manual route some, autoroute rest. Fiddle. | 20070917 WestfW: Now V1.16. Change components to TH. | 20070911 WestfW: Now V1.15. Move tracks slightly for shielding | 20070900 Daniel: Schematic and initial placement
_tsilk: C12 | C8 | 3 2 1 0 9 8 | 7 6 5 4 3 2 1 0 | RX | TX | 1 1 1 1 | Digital | X2 | AREF | GND | R7 | PWM | PWM | PWM | PWM | PWM | PWM | PWR | IC1 | 13 | Freeduino | FT232RL | c | c | R10 | V1.16 | TX | R8 | RX | 16Mhz | 1 | R1 | R9 | C3 | C10 | R12 | ]USB | R11 | ]EXT | F1 | Q1 | C2 | ICSP | RESET | 1 | CRS | M. Banzi | D. Cuartielles | D. Mellis | N. Zambetti | C5 | C4 | ATMEGA168 | IC2 | D1 | C1 | 47u | C7 | 47u | C6 | C9 | Analog in | 5V Gnd 9V | RESET | 3.3V | 0 1 2 3 4 5 | 9V in